# EAGLE board LED-Controller (EAGLE 5.11), part 1 of 2
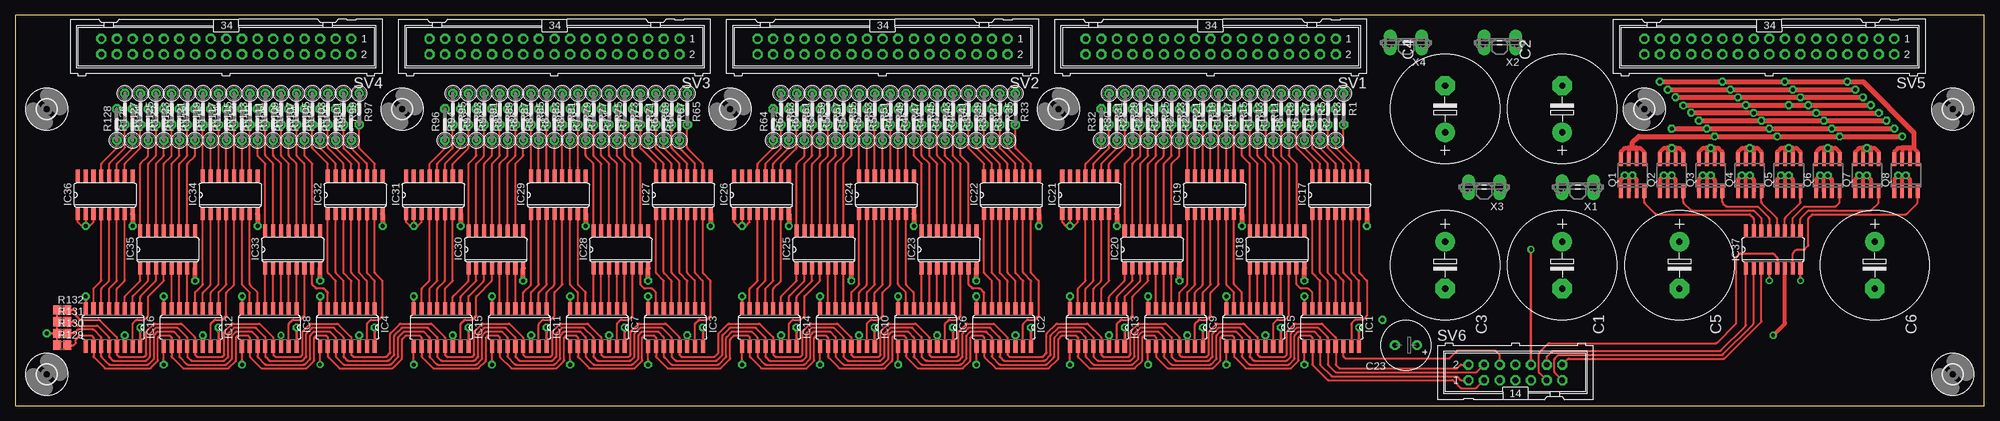
[diagram p3: board, top side]
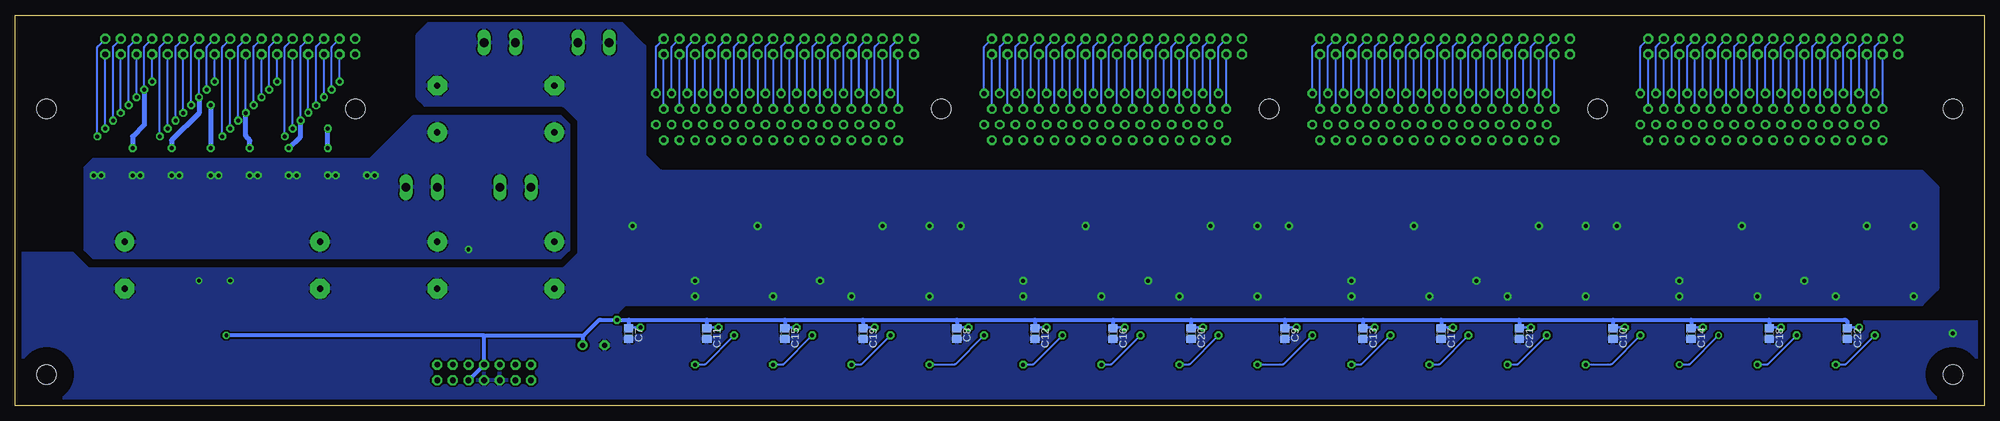
[diagram p4: board, bottom side, seen from below]

Size 320.04 x 63.5 mm. Coordinates in mm from the lower left corner, seen from the top.
Outline: 0,0 320.04,0 320.04,63.5 0,63.5 0,0
Copper layers (1*16): Top 0.035mm / dielectric 1.5mm / Bottom 0.035mm
Design rules "default *": minimum track width 10mil, minimum drill 24mil, track to track 8mil, track to pad 8mil, pad to pad 8mil, via to via 8mil, smd to smd 8mil, copper to edge 40mil, drill to drill 8mil, minimum pad ring 14mil, minimum via ring 10mil, stop-mask expansion 4mil, vias tented up to drill 0mil, thermal gap 10mil

## Footprints (pad centres in the part's own frame; a part is rotated, then mirrored left to right if it is on the bottom)
E7,5-18 = drill 1.016 pad 3.15 round: + -3.81,0 | drill 1.016 pad 3.15 octagon: - 3.81,0
C0805 = smd 1.3 x 1.5: 1 -0.85,0; 2 0.85,0
E3,5-8 = drill 0.813 pad 1.6 round: + -1.778,0 | drill 0.813 pad 1.6 octagon: - 1.778,0
SO16 = smd 0.66 x 2.032: 1 -4.445,-3.073; 2 -3.175,-3.073; 3 -1.905,-3.073; 4 -0.635,-3.073; 5 0.635,-3.073; 6 1.905,-3.073; 7 3.175,-3.073; 8 4.445,-3.073; 9 4.445,3.073; 10 3.175,3.073; 11 1.905,3.073; 12 0.635,3.073; 13 -0.635,3.073; 14 -1.905,3.073; 15 -3.175,3.073; 16 -4.445,3.073
SO-08 = smd 0.6 x 2.2: 1 -1.905,-2.6; 2 -0.635,-2.6; 3 0.635,-2.6; 4 1.905,-2.6; 5 1.905,2.6; 6 0.635,2.6; 7 -0.635,2.6; 8 -1.905,2.6
0207/5V = drill 0.813 octagon: 1 -2.54,0; 2 2.54,0
R0805 = smd 1.3 x 1.5: 1 -0.85,0; 2 0.85,0
ML34 = drill 0.914 octagon: 1 -20.32,-1.27; 2 -20.32,1.27; 3 -17.78,-1.27; 4 -17.78,1.27; 5 -15.24,-1.27; 6 -15.24,1.27; 7 -12.7,-1.27; 8 -12.7,1.27; 9 -10.16,-1.27; 10 -10.16,1.27; 11 -7.62,-1.27; 12 -7.62,1.27; 13 -5.08,-1.27; 14 -5.08,1.27; 15 -2.54,-1.27; 16 -2.54,1.27; 17 0,-1.27; 18 0,1.27; 19 2.54,-1.27; 20 2.54,1.27; 21 5.08,-1.27; 22 5.08,1.27; 23 7.62,-1.27; 24 7.62,1.27; 25 10.16,-1.27; 26 10.16,1.27; 27 12.7,-1.27; 28 12.7,1.27; 29 15.24,-1.27; 30 15.24,1.27; 31 17.78,-1.27; 32 17.78,1.27; 33 20.32,-1.27; 34 20.32,1.27
ML14 = drill 0.914 octagon: 1 -7.62,-1.27; 2 -7.62,1.27; 3 -5.08,-1.27; 4 -5.08,1.27; 5 -2.54,-1.27; 6 -2.54,1.27; 7 0,-1.27; 8 0,1.27; 9 2.54,-1.27; 10 2.54,1.27; 11 5.08,-1.27; 12 5.08,1.27; 13 7.62,-1.27; 14 7.62,1.27
3,2 = hole 3.2: 0,0
ST6,3 = drill 1.397 long: 1 -2.54,0; 2 2.54,0

## Placement (x,y rotation side)
C1  3300µ/10V  [E7,5-18]  251.46,22.86 270 top
C2  3300µ/10V  [E7,5-18]  251.46,48.26 90 top
C3  3300µ/10V  [E7,5-18]  232.41,22.86 270 top
C4  3300µ/10V  [E7,5-18]  232.41,48.26 90 top
C5  3300µ/10V  [E7,5-18]  270.51,22.86 270 top
C6  3300µ/10V  [E7,5-18]  302.26,22.86 270 top
C7  [C0805]  220.34,11.75 270 bottom
C8  [C0805]  167,11.75 270 bottom
C9  [C0805]  113.67,11.75 270 bottom
C10  [C0805]  60.33,11.75 270 bottom
C11  [C0805]  207.65,11.75 270 bottom
C12  [C0805]  154.31,11.75 270 bottom
C13  [C0805]  100.97,11.75 270 bottom
C14  [C0805]  47.62,11.75 270 bottom
C15  [C0805]  194.94,11.75 270 bottom
C16  [C0805]  141.6,11.75 270 bottom
C17  [C0805]  88.27,11.75 270 bottom
C18  [C0805]  34.92,11.75 270 bottom
C19  [C0805]  182.25,11.75 270 bottom
C20  [C0805]  128.91,11.75 270 bottom
C21  [C0805]  75.56,11.75 270 bottom
C22  [C0805]  22.23,11.75 270 bottom
C23  [E3,5-8]  226.06,9.84 180 top
IC1  74HCT595D  [SO16]  214,12.7 180 top
IC2  74HCT595D  [SO16]  160.66,12.7 180 top
IC3  74HCT595D  [SO16]  107.31,12.7 180 top
IC4  74HCT595D  [SO16]  53.98,12.7 180 top
IC5  74HCT595D  [SO16]  201.29,12.7 180 top
IC6  74HCT595D  [SO16]  147.96,12.7 180 top
IC7  74HCT595D  [SO16]  94.61,12.7 180 top
IC8  74HCT595D  [SO16]  41.27,12.7 180 top
IC9  74HCT595D  [SO16]  188.59,12.7 180 top
IC10  74HCT595D  [SO16]  135.25,12.7 180 top
IC11  74HCT595D  [SO16]  81.92,12.7 180 top
IC12  74HCT595D  [SO16]  28.57,12.7 180 top
IC13  74HCT595D  [SO16]  175.9,12.7 180 top
IC14  74HCT595D  [SO16]  122.56,12.7 180 top
IC15  74HCT595D  [SO16]  69.22,12.7 180 top
IC16  74HCT595D  [SO16]  15.88,12.7 180 top
IC17  ULN2003AD  [SO16]  215.26,34.29 0 top
IC18  ULN2003AD  [SO16]  205.1,25.4 0 top
IC19  ULN2003AD  [SO16]  194.94,34.29 0 top
IC20  ULN2003AD  [SO16]  184.78,25.4 0 top
IC21  ULN2003AD  [SO16]  174.62,34.29 0 top
IC22  ULN2003AD  [SO16]  161.93,34.29 0 top
IC23  ULN2003AD  [SO16]  151.76,25.4 0 top
IC24  ULN2003AD  [SO16]  141.6,34.29 0 top
IC25  ULN2003AD  [SO16]  131.44,25.4 0 top
IC26  ULN2003AD  [SO16]  121.28,34.29 0 top
IC27  ULN2003AD  [SO16]  108.58,34.29 0 top
IC28  ULN2003AD  [SO16]  98.42,25.4 0 top
IC29  ULN2003AD  [SO16]  88.27,34.29 0 top
IC30  ULN2003AD  [SO16]  78.11,25.4 0 top
IC31  ULN2003AD  [SO16]  67.94,34.29 0 top
IC32  ULN2003AD  [SO16]  55.24,34.29 0 top
IC33  ULN2003AD  [SO16]  45.09,25.4 0 top
IC34  ULN2003AD  [SO16]  34.92,34.29 0 top
IC35  ULN2003AD  [SO16]  24.77,25.4 0 top
IC36  ULN2003AD  [SO16]  14.61,34.29 0 top
IC37  74HCT138D  [SO16]  285.75,25.4 0 top
Q1  irf7416p  [SO-08]  262.89,37.46 0 top
Q2  irf7416p  [SO-08]  269.24,37.46 0 top
Q3  irf7416p  [SO-08]  275.59,37.46 0 top
Q4  irf7416p  [SO-08]  281.94,37.46 0 top
Q5  irf7416p  [SO-08]  288.29,37.46 0 top
Q6  irf7416p  [SO-08]  294.64,37.46 0 top
Q7  irf7416p  [SO-08]  300.99,37.46 0 top
Q8  irf7416p  [SO-08]  307.34,37.46 0 top
R1  [0207/5V]  215.9,48.26 270 top
R2  [0207/5V]  214.63,45.72 90 top
R3  [0207/5V]  213.36,48.26 270 top
R4  [0207/5V]  212.09,45.72 90 top
R5  [0207/5V]  210.82,48.26 270 top
R6  [0207/5V]  209.55,45.72 90 top
R7  [0207/5V]  208.28,48.26 270 top
R8  [0207/5V]  207.01,45.72 90 top
R9  [0207/5V]  205.74,48.26 270 top
R10  [0207/5V]  204.47,45.72 90 top
R11  [0207/5V]  203.2,48.26 270 top
R12  [0207/5V]  201.93,45.72 90 top
R13  [0207/5V]  200.66,48.26 270 top
R14  [0207/5V]  199.39,45.72 90 top
R15  [0207/5V]  198.12,48.26 270 top
R16  [0207/5V]  196.85,45.72 90 top
R17  [0207/5V]  195.58,48.26 270 top
R18  [0207/5V]  194.31,45.72 90 top
R19  [0207/5V]  193.04,48.26 270 top
R20  [0207/5V]  191.77,45.72 90 top
R21  [0207/5V]  190.5,48.26 270 top
R22  [0207/5V]  189.23,45.72 90 top
R23  [0207/5V]  187.96,48.26 270 top
R24  [0207/5V]  186.69,45.72 90 top
R25  [0207/5V]  185.42,48.26 270 top
R26  [0207/5V]  184.15,45.72 90 top
R27  [0207/5V]  182.88,48.26 270 top
R28  [0207/5V]  181.61,45.72 90 top
R29  [0207/5V]  180.34,48.26 270 top
R30  [0207/5V]  179.07,45.72 90 top
R31  [0207/5V]  177.8,48.26 270 top
R32  [0207/5V]  176.53,45.72 90 top
R33  [0207/5V]  162.56,48.26 270 top
R34  [0207/5V]  161.29,45.72 90 top
R35  [0207/5V]  160.02,48.26 270 top
R36  [0207/5V]  158.75,45.72 90 top
R37  [0207/5V]  157.48,48.26 270 top
R38  [0207/5V]  156.21,45.72 90 top
R39  [0207/5V]  154.94,48.26 270 top
R40  [0207/5V]  153.67,45.72 90 top
R41  [0207/5V]  152.4,48.26 270 top
R42  [0207/5V]  151.13,45.72 90 top
R43  [0207/5V]  149.86,48.26 270 top
R44  [0207/5V]  148.59,45.72 90 top
R45  [0207/5V]  147.32,48.26 270 top
R46  [0207/5V]  146.05,45.72 90 top
R47  [0207/5V]  144.78,48.26 270 top
R48  [0207/5V]  143.51,45.72 90 top
R49  [0207/5V]  142.24,48.26 270 top
R50  [0207/5V]  140.97,45.72 90 top
R51  [0207/5V]  139.7,48.26 270 top
R52  [0207/5V]  138.43,45.72 90 top
R53  [0207/5V]  137.16,48.26 270 top
R54  [0207/5V]  135.89,45.72 90 top
R55  [0207/5V]  134.62,48.26 270 top
R56  [0207/5V]  133.35,45.72 90 top
R57  [0207/5V]  132.08,48.26 270 top
R58  [0207/5V]  130.81,45.72 90 top
R59  [0207/5V]  129.54,48.26 270 top
R60  [0207/5V]  128.27,45.72 90 top
R61  [0207/5V]  127,48.26 270 top
R62  [0207/5V]  125.73,45.72 90 top
R63  [0207/5V]  124.46,48.26 270 top
R64  [0207/5V]  123.19,45.72 90 top
R65  [0207/5V]  109.22,48.26 270 top
R66  [0207/5V]  107.95,45.72 90 top
R67  [0207/5V]  106.68,48.26 270 top
R68  [0207/5V]  105.41,45.72 90 top
R69  [0207/5V]  104.14,48.26 270 top
R70  [0207/5V]  102.87,45.72 90 top
R71  [0207/5V]  101.6,48.26 270 top
R72  [0207/5V]  100.33,45.72 90 top
R73  [0207/5V]  99.06,48.26 270 top
R74  [0207/5V]  97.79,45.72 90 top
R75  [0207/5V]  96.52,48.26 270 top
R76  [0207/5V]  95.25,45.72 90 top
R77  [0207/5V]  93.98,48.26 270 top
R78  [0207/5V]  92.71,45.72 90 top
R79  [0207/5V]  91.44,48.26 270 top
R80  [0207/5V]  90.17,45.72 90 top
R81  [0207/5V]  88.9,48.26 270 top
R82  [0207/5V]  87.63,45.72 90 top
R83  [0207/5V]  86.36,48.26 270 top
R84  [0207/5V]  85.09,45.72 90 top
R85  [0207/5V]  83.82,48.26 270 top
R86  [0207/5V]  82.55,45.72 90 top
R87  [0207/5V]  81.28,48.26 270 top
R88  [0207/5V]  80.01,45.72 90 top
R89  [0207/5V]  78.74,48.26 270 top
R90  [0207/5V]  77.47,45.72 90 top
R91  [0207/5V]  76.2,48.26 270 top
R92  [0207/5V]  74.93,45.72 90 top
R93  [0207/5V]  73.66,48.26 270 top
R94  [0207/5V]  72.39,45.72 90 top
R95  [0207/5V]  71.12,48.26 270 top
R96  [0207/5V]  69.85,45.72 90 top
R97  [0207/5V]  55.88,48.26 270 top
R98  [0207/5V]  54.61,45.72 90 top
R99  [0207/5V]  53.34,48.26 270 top
R100  [0207/5V]  52.07,45.72 90 top
R101  [0207/5V]  50.8,48.26 270 top
R102  [0207/5V]  49.53,45.72 90 top
R103  [0207/5V]  48.26,48.26 270 top
R104  [0207/5V]  46.99,45.72 90 top
R105  [0207/5V]  45.72,48.26 270 top
R106  [0207/5V]  44.45,45.72 90 top
R107  [0207/5V]  43.18,48.26 270 top
R108  [0207/5V]  41.91,45.72 90 top
R109  [0207/5V]  40.64,48.26 270 top
R110  [0207/5V]  39.37,45.72 90 top
R111  [0207/5V]  38.1,48.26 270 top
R112  [0207/5V]  36.83,45.72 90 top
R113  [0207/5V]  35.56,48.26 270 top
R114  [0207/5V]  34.29,45.72 90 top
R115  [0207/5V]  33.02,48.26 270 top
R116  [0207/5V]  31.75,45.72 90 top
R117  [0207/5V]  30.48,48.26 270 top
R118  [0207/5V]  29.21,45.72 90 top
R119  [0207/5V]  27.94,48.26 270 top
R120  [0207/5V]  26.67,45.72 90 top
R121  [0207/5V]  25.4,48.26 270 top
R122  [0207/5V]  24.13,45.72 90 top
R123  [0207/5V]  22.86,48.26 270 top
R124  [0207/5V]  21.59,45.72 90 top
R125  [0207/5V]  20.32,48.26 270 top
R126  [0207/5V]  19.05,45.72 90 top
R127  [0207/5V]  17.78,48.26 270 top
R128  [0207/5V]  16.51,45.72 90 top
R129  390  [R0805]  7.62,9.84 0 top
R130  390  [R0805]  7.62,11.75 0 top
R131  390  [R0805]  7.62,13.65 0 top
R132  390  [R0805]  7.62,15.56 0 top
SV1  [ML34]  194.31,58.42 180 top
SV2  [ML34]  140.97,58.42 180 top
SV3  [ML34]  87.63,58.42 180 top
SV4  [ML34]  34.29,58.42 180 top
SV5  [ML34]  285.12,58.42 180 top
SV6  [ML14]  243.84,5.4 0 top
U$1  [3,2]  62.87,48.26 0 top
U$2  [3,2]  5.08,48.26 0 top
U$3  [3,2]  5.08,5.08 0 top
U$4  [3,2]  116.2,48.26 0 top
U$5  [3,2]  169.54,48.26 0 top
U$6  [3,2]  264.8,48.26 0 top
U$7  [3,2]  314.96,48.26 0 top
U$8  [3,2]  314.96,5.08 0 top
X1  [ST6,3]  254,35.56 180 top
X2  [ST6,3]  241.3,59.05 180 top
X3  [ST6,3]  238.76,35.56 180 top
X4  [ST6,3]  226.06,59.05 180 top

## Tracks (layer width: path | path; a pad name or v marks a point on that pad's centre or on a via)
!ACT
  Top 0.305: SV6.11 247.74,5.3 arc-45 247.65,5.53 247.65,8.44 arc-45 247.74,8.67 249.14,10.07 arc-45 249.37,10.16 276.41,10.16 arc45 276.63,10.25 279.62,13.24 arc45 279.72,13.47 279.72,24 arc-45 279.81,24.22 280.26,24.67 arc-45 280.48,24.77 285.62,24.77 arc-45 285.84,24.67 286.29,24.22 arc-45 286.38,24 IC37.5
!CLR_SHIFT
  Top 0.305: R129.2 9.39,9.84 arc45 9.62,9.94 9.75,10.07 arc45 9.84,10.29 9.84,10.66 arc-45 9.94,10.89 10.38,11.34 arc-45 10.61,11.43 12.25,11.43 arc-45 12.48,11.34 12.61,11.21 arc-45 12.7,10.98 IC16.10 12.7,8.07 arc45 12.79,7.84 14.51,6.13 arc45 14.74,6.03 21.78,6.03 arc45 22,6.13 23.08,7.21 arc45 23.18,7.43 23.18,10.98 arc-45 23.27,11.21 23.4,11.34 arc-45 23.63,11.43 24.95,11.43 arc-45 25.18,11.34 25.31,11.21 arc-45 25.4,10.98 IC12.10 25.4,8.07 arc45 25.49,7.84 27.21,6.13 arc45 27.44,6.03 34.48,6.03 arc45 34.7,6.13 35.78,7.21 arc45 35.88,7.43 35.88,10.98 arc-45 35.97,11.21 36.1,11.34 arc-45 36.33,11.43 37.65,11.43 arc-45 37.88,11.34 38.01,11.21 arc-45 38.1,10.98 IC8.10 38.1,8.07 arc45 38.19,7.84 39.91,6.13 arc45 40.14,6.03 47.18,6.03 arc45 47.4,6.13 48.48,7.21 arc45 48.58,7.43 48.58,10.98 arc-45 48.67,11.21 48.8,11.34 arc-45 49.03,11.43 50.35,11.43 arc-45 50.58,11.34 50.71,11.21 arc-45 50.8,10.98 IC4.10 50.8,8.07 arc45 50.89,7.84 52.61,6.13 arc45 52.84,6.03 61.15,6.03 arc45 61.37,6.13 62.77,7.53 arc45 62.87,7.75 62.87,10.66 arc-45 62.96,10.89 63.41,11.34 arc-45 63.63,11.43 65.59,11.43 arc-45 65.82,11.34 65.95,11.21 arc-45 66.04,10.98 IC15.10 66.04,8.07 arc45 66.13,7.84 67.85,6.13 arc45 68.08,6.03 75.12,6.03 arc45 75.34,6.13 76.42,7.21 arc45 76.52,7.43 76.52,10.98 arc-45 76.61,11.21 76.74,11.34 arc-45 76.97,11.43 78.29,11.43 arc-45 78.52,11.34 78.65,11.21 arc-45 78.74,10.98 IC11.10 78.74,8.07 arc45 78.83,7.84 80.55,6.13 arc45 80.78,6.03 87.82,6.03 arc45 88.04,6.13 89.12,7.21 arc45 89.22,7.43 89.22,10.98 arc-45 89.31,11.21 89.44,11.34 arc-45 89.67,11.43 90.99,11.43 arc-45 91.22,11.34 91.35,11.21 arc-45 91.44,10.98 IC7.10 91.44,8.07 arc45 91.53,7.84 93.25,6.13 arc45 93.48,6.03 100.52,6.03 arc45 100.74,6.13 101.83,7.21 arc45 101.92,7.43 101.92,10.98 arc-45 102.01,11.21 102.14,11.34 arc-45 102.37,11.43 103.69,11.43 arc-45 103.92,11.34 104.05,11.21 arc-45 104.14,10.98 IC3.10 104.14,8.07 arc45 104.23,7.84 105.95,6.13 arc45 106.18,6.03 114.49,6.03 arc45 114.71,6.13 116.11,7.53 arc45 116.2,7.75 116.2,10.66 arc-45 116.3,10.89 116.75,11.34 arc-45 116.97,11.43 118.93,11.43 arc-45 119.16,11.34 119.29,11.21 arc-45 119.38,10.98 IC14.10 119.38,8.07 arc45 119.47,7.84 121.19,6.13 arc45 121.42,6.03 128.46,6.03 arc45 128.68,6.13 129.76,7.21 arc45 129.86,7.43 129.86,10.98 arc-45 129.95,11.21 130.18,11.43 131.63,11.43 arc-45 131.86,11.34 131.99,11.21 arc-45 132.08,10.98 IC10.10 132.08,8.07 arc45 132.17,7.84 133.89,6.13 arc45 134.12,6.03 141.16,6.03 arc45 141.38,6.13 142.46,7.21 arc45 142.56,7.43 142.56,10.98 arc-45 142.65,11.21 142.78,11.34 arc-45 143.01,11.43 144.33,11.43 arc-45 144.56,11.34 144.69,11.21 arc-45 144.78,10.98 IC6.10 144.78,8.07 arc45 144.87,7.84 146.59,6.13 arc45 146.82,6.03 153.86,6.03 arc45 154.08,6.13 155.16,7.21 arc45 155.26,7.43 155.26,10.98 arc-45 155.35,11.21 155.48,11.34 arc-45 155.71,11.43 157.03,11.43 arc-45 157.26,11.34 157.39,11.21 arc-45 157.48,10.98 IC2.10 157.48,8.07 arc45 157.57,7.84 159.29,6.13 arc45 159.52,6.03 167.83,6.03 arc45 168.05,6.13 169.45,7.53 arc45 169.54,7.75 169.54,10.66 arc-45 169.64,10.89 170.09,11.34 arc-45 170.31,11.43 172.27,11.43 arc-45 172.5,11.34 172.63,11.21 arc-45 172.72,10.98 IC13.10 172.72,8.07 arc45 172.81,7.84 174.53,6.13 arc45 174.76,6.03 181.8,6.03 arc45 182.02,6.13 183.1,7.21 arc45 183.2,7.43 183.2,10.98 arc-45 183.29,11.21 183.42,11.34 arc-45 183.65,11.43 184.97,11.43 arc-45 185.2,11.34 185.33,11.21 arc-45 185.42,10.98 IC9.10 185.42,8.07 arc45 185.51,7.84 187.23,6.13 arc45 187.46,6.03 194.5,6.03 arc45 194.72,6.13 195.8,7.21 arc45 195.9,7.43 195.9,10.98 arc-45 195.99,11.21 196.12,11.34 arc-45 196.35,11.43 197.67,11.43 arc-45 197.9,11.34 198.03,11.21 arc-45 198.12,10.98 IC5.10 198.12,8.07 arc45 198.21,7.84 199.93,6.13 arc45 200.16,6.03 207.2,6.03 arc45 207.42,6.13 208.5,7.21 arc45 208.6,7.43 208.6,10.98 arc-45 208.69,11.21 208.82,11.34 arc-45 209.05,11.43 210.37,11.43 arc-45 210.59,11.34 210.73,11.21 arc-45 210.82,10.98 IC1.10 210.82,6.8 arc45 210.91,6.58 213.27,4.22 arc45 213.49,4.13 233.55,4.13 arc-45 233.77,4.03 234.86,2.95 arc45 235.08,2.86 237.36,2.86 arc45 237.58,2.95 SV6.3
!OE
  Top 0.305: R132.2 9.39,15.56 arc-45 9.62,15.46 9.75,15.33 arc-45 9.84,15.11 9.84,14.74 arc45 9.94,14.51 10.38,14.06 arc45 10.61,13.97 13.52,13.97 arc-45 13.74,13.88 16.42,11.21 arc-45 16.51,10.98 IC16.13 16.51,8.39 arc45 16.6,8.16 16.73,8.03 arc45 16.96,7.94 20.82,7.94 arc45 21.05,8.03 21.18,8.16 arc45 21.27,8.39 21.27,11.93 arc-45 21.37,12.16 22.45,13.24 arc-45 22.67,13.33 26.86,13.33 arc-45 27.08,13.24 29.12,11.21 arc-45 29.21,10.98 IC12.13 29.21,8.39 arc45 29.3,8.16 29.43,8.03 arc45 29.66,7.94 33.52,7.94 arc45 33.75,8.03 33.88,8.16 arc45 33.97,8.39 33.97,11.93 arc-45 34.07,12.16 35.15,13.24 arc-45 35.37,13.33 39.56,13.33 arc-45 39.78,13.24 41.82,11.21 arc-45 41.91,10.98 IC8.13 41.91,8.39 arc45 42,8.16 42.13,8.03 arc45 42.36,7.94 46.22,7.94 arc45 46.45,8.03 46.58,8.16 arc45 46.67,8.39 46.67,11.93 arc-45 46.77,12.16 47.85,13.24 arc-45 48.07,13.33 52.26,13.33 arc-45 52.48,13.24 54.52,11.21 arc-45 54.61,10.98 IC4.13 54.61,8.39 arc45 54.7,8.16 54.83,8.03 arc45 55.06,7.94 60.19,7.94 arc45 60.42,8.03 60.87,8.48 arc45 60.96,8.7 60.96,11.62 arc-45 61.05,11.84 62.45,13.24 arc-45 62.68,13.33 67.5,13.33 arc-45 67.72,13.24 69.76,11.21 arc-45 69.85,10.98 IC15.13 69.85,8.39 arc45 69.94,8.16 70.08,8.03 arc45 70.3,7.94 74.16,7.94 arc45 74.39,8.03 74.52,8.16 arc45 74.61,8.39 74.61,11.93 arc-45 74.71,12.16 75.79,13.24 arc-45 76.01,13.33 80.2,13.33 arc-45 80.42,13.24 82.46,11.21 arc-45 82.55,10.98 IC11.13 82.55,8.39 arc45 82.64,8.16 82.78,8.03 arc45 83,7.94 86.86,7.94 arc45 87.09,8.03 87.22,8.16 arc45 87.31,8.39 87.31,11.93 arc-45 87.41,12.16 88.49,13.24 arc-45 88.71,13.33 92.9,13.33 arc-45 93.12,13.24 95.16,11.21 arc-45 95.25,10.98 IC7.13 95.25,8.39 arc45 95.34,8.16 95.47,8.03 arc45 95.7,7.94 99.56,7.94 arc45 99.79,8.03 99.92,8.16 arc45 100.01,8.39 100.01,11.93 arc-45 100.11,12.16 101.19,13.24 arc-45 101.41,13.33 105.6,13.33 arc-45 105.82,13.24 107.86,11.21 arc-45 107.95,10.98 IC3.13 107.95,8.39 arc45 108.04,8.16 108.17,8.03 arc45 108.4,7.94 113.53,7.94 arc45 113.76,8.03 114.21,8.48 arc45 114.3,8.7 114.3,11.62 arc-45 114.39,11.84 115.79,13.24 arc-45 116.02,13.33 120.84,13.33 arc-45 121.06,13.24 123.1,11.21 arc-45 123.19,10.98 IC14.13 123.19,8.39 arc45 123.28,8.16 123.42,8.03 arc45 123.64,7.94 127.5,7.94 arc45 127.73,8.03 127.86,8.16 arc45 127.95,8.39 127.95,11.93 arc-45 128.05,12.16 129.13,13.24 arc-45 129.35,13.33 133.54,13.33 arc-45 133.76,13.24 135.8,11.21 arc-45 135.89,10.98 IC10.13 135.89,8.39 arc45 135.98,8.16 136.11,8.03 arc45 136.34,7.94 140.2,7.94 arc45 140.43,8.03 140.56,8.16 arc45 140.65,8.39 140.65,11.93 arc-45 140.75,12.16 141.83,13.24 arc-45 142.05,13.33 146.24,13.33 arc-45 146.46,13.24 148.5,11.21 arc-45 148.59,10.98 IC6.13 148.59,8.39 arc45 148.68,8.16 148.81,8.03 arc45 149.04,7.94 152.9,7.94 arc45 153.13,8.03 153.26,8.16 arc45 153.35,8.39 153.35,11.93 arc-45 153.45,12.16 154.53,13.24 arc-45 154.75,13.33 158.94,13.33 arc-45 159.16,13.24 161.2,11.21 arc-45 161.29,10.98 IC2.13 161.29,8.39 arc45 161.38,8.16 161.51,8.03 arc45 161.74,7.94 166.87,7.94 arc45 167.1,8.03 167.55,8.48 arc45 167.64,8.7 167.64,11.62 arc-45 167.73,11.84 169.13,13.24 arc-45 169.36,13.33 174.18,13.33 arc-45 174.4,13.24 176.44,11.21 arc-45 176.53,10.98 IC13.13 176.53,8.39 arc45 176.62,8.16 176.75,8.03 arc45 176.98,7.94 180.84,7.94 arc45 181.07,8.03 181.09,8.05 arc45 181.29,8.55 181.29,11.93 arc-45 181.39,12.16 182.47,13.24 arc-45 182.69,13.33 186.88,13.33 arc-45 187.1,13.24 189.14,11.21 arc-45 189.23,10.98 IC9.13 189.23,8.39 arc45 189.32,8.16 189.42,8.07 arc45 189.73,7.94 193.54,7.94 arc45 193.77,8.03 193.9,8.16 arc45 193.99,8.39 193.99,11.93 arc-45 194.09,12.16 195.17,13.24 arc-45 195.39,13.33 199.58,13.33 arc-45 199.8,13.24 201.84,11.21 arc-45 201.93,10.98 IC5.13 201.93,8.39 arc45 202.02,8.16 202.16,8.03 arc45 202.38,7.94 206.24,7.94 arc45 206.47,8.03 206.6,8.16 arc45 206.69,8.39 206.69,11.93 arc-45 206.79,12.16 207.87,13.24 arc-45 208.09,13.33 212.28,13.33 arc-45 212.5,13.24 214.54,11.21 arc-45 214.63,10.98 IC1.13 214.63,6.8 arc45 214.72,6.58 215.17,6.13 arc45 215.4,6.03 234.18,6.03 arc45 234.41,6.13 234.86,6.58 arc-45 235.08,6.67 SV6.2
!STROBE
  Top 0.305: R131.2 9.39,13.65 arc-45 9.62,13.56 10.07,13.11 arc45 10.29,13.02 13.2,13.02 arc-45 13.43,12.92 15.15,11.21 arc-45 15.24,10.98 IC16.12 15.24,8.07 arc45 15.33,7.84 15.78,7.39 arc45 16.01,7.3 21.14,7.3 arc45 21.37,7.39 21.81,7.84 arc45 21.91,8.07 21.91,11.62 arc-45 22,11.84 22.77,12.61 arc-45 22.99,12.7 26.22,12.7 arc-45 26.45,12.61 27.85,11.21 arc-45 27.94,10.98 IC12.12 27.94,8.07 arc45 28.03,7.84 28.48,7.39 arc45 28.71,7.3 33.84,7.3 arc45 34.07,7.39 34.51,7.84 arc45 34.61,8.07 34.61,11.62 arc-45 34.7,11.84 35.47,12.61 arc-45 35.69,12.7 38.92,12.7 arc-45 39.15,12.61 40.55,11.21 arc-45 40.64,10.98 IC8.12 40.64,8.07 arc45 40.73,7.84 41.18,7.39 arc45 41.41,7.3 46.54,7.3 arc45 46.77,7.39 47.22,7.84 arc45 47.31,8.07 47.31,11.62 arc-45 47.4,11.84 48.17,12.61 arc-45 48.39,12.7 51.62,12.7 arc-45 51.85,12.61 53.25,11.21 arc-45 53.34,10.98 IC4.12 53.34,8.07 arc45 53.43,7.84 53.88,7.39 arc45 54.11,7.3 60.51,7.3 arc45 60.74,7.39 61.5,8.16 arc45 61.59,8.39 61.59,11.3 arc-45 61.69,11.52 62.77,12.61 arc-45 63,12.7 66.86,12.7 arc-45 67.08,12.61 68.49,11.21 arc-45 68.58,10.98 IC15.12 68.58,8.07 arc45 68.67,7.84 69.12,7.39 arc45 69.35,7.3 74.48,7.3 arc45 74.71,7.39 75.15,7.84 arc45 75.25,8.07 75.25,11.62 arc-45 75.34,11.84 76.11,12.61 arc-45 76.33,12.7 79.56,12.7 arc-45 79.78,12.61 81.19,11.21 arc-45 81.28,10.98 IC11.12 81.28,8.07 arc45 81.37,7.84 81.82,7.39 arc45 82.05,7.3 87.18,7.3 arc45 87.41,7.39 87.86,7.84 arc45 87.95,8.07 87.95,11.62 arc-45 88.04,11.84 88.81,12.61 arc-45 89.03,12.7 92.26,12.7 arc-45 92.49,12.61 93.89,11.21 arc-45 93.98,10.98 IC7.12 93.98,8.07 arc45 94.07,7.84 94.52,7.39 arc45 94.75,7.3 99.88,7.3 arc45 100.11,7.39 100.56,7.84 arc45 100.65,8.07 100.65,11.62 arc-45 100.74,11.84 101.51,12.61 arc-45 101.73,12.7 104.96,12.7 arc-45 105.19,12.61 106.59,11.21 arc-45 106.68,10.98 IC3.12 106.68,8.07 arc45 106.77,7.84 107.22,7.39 arc45 107.45,7.3 113.85,7.3 arc45 114.08,7.39 114.84,8.16 arc45 114.94,8.39 114.94,11.3 arc-45 115.03,11.52 116.11,12.61 arc-45 116.34,12.7 120.2,12.7 arc-45 120.42,12.61 121.83,11.21 arc-45 121.92,10.98 IC14.12 121.92,8.07 arc45 122.01,7.84 122.46,7.39 arc45 122.69,7.3 127.82,7.3 arc45 128.05,7.39 128.49,7.84 arc45 128.59,8.07 128.59,11.62 arc-45 128.68,11.84 129.54,12.7 132.9,12.7 arc-45 133.12,12.61 134.53,11.21 arc-45 134.62,10.98 IC10.12 134.62,8.07 arc45 134.71,7.84 135.16,7.39 arc45 135.39,7.3 140.52,7.3 arc45 140.75,7.39 141.19,7.84 arc45 141.29,8.07 141.29,11.62 arc-45 141.38,11.84 142.15,12.61 arc-45 142.37,12.7 145.6,12.7 arc-45 145.83,12.61 147.23,11.21 arc-45 147.32,10.98 IC6.12 147.32,8.07 arc45 147.41,7.84 147.77,7.49 arc45 148.22,7.3 153.22,7.3 arc45 153.45,7.39 153.89,7.84 arc45 153.99,8.07 153.99,11.62 arc-45 154.08,11.84 154.85,12.61 arc-45 155.07,12.7 158.3,12.7 arc-45 158.53,12.61 159.93,11.21 arc-45 160.02,10.98 IC2.12 160.02,8.07 arc45 160.11,7.84 160.56,7.39 arc45 160.79,7.3 167.19,7.3 arc45 167.42,7.39 168.18,8.16 arc45 168.28,8.39 168.28,11.3 arc-45 168.37,11.52 169.45,12.61 arc-45 169.68,12.7 173.54,12.7 arc-45 173.77,12.61 175.17,11.21 arc-45 175.26,10.98 IC13.12 175.26,8.07 arc45 175.35,7.84 175.8,7.39 arc45 176.03,7.3 181.16,7.3 arc45 181.39,7.39 181.83,7.84 arc45 181.93,8.07 181.93,11.62 arc-45 182.02,11.84 182.79,12.61 arc-45 183.01,12.7 186.24,12.7 arc-45 186.47,12.61 187.87,11.21 arc-45 187.96,10.98 IC9.12 187.96,8.07 arc45 188.05,7.84 188.5,7.39 arc45 188.73,7.3 193.86,7.3 arc45 194.09,7.39 194.53,7.84 arc45 194.63,8.07 194.63,11.62 arc-45 194.72,11.84 195.49,12.61 arc-45 195.71,12.7 198.94,12.7 arc-45 199.17,12.61 200.57,11.21 arc-45 200.66,10.98 IC5.12 200.66,8.07 arc45 200.75,7.84 201.2,7.39 arc45 201.43,7.3 206.56,7.3 arc45 206.79,7.39 207.23,7.84 arc45 207.33,8.07 207.33,11.62 arc-45 207.42,11.84 208.19,12.61 arc-45 208.41,12.7 211.64,12.7 arc-45 211.87,12.61 213.27,11.21 arc-45 213.36,10.98 IC1.12 213.36,6.8 arc45 213.45,6.58 214.54,5.49 arc45 214.76,5.4 237.36,5.4 arc45 237.58,5.49 SV6.4
+5V  (via drill 0.6, 0.65 pad 1.27)
  Top 0.406: v20.32,12.7 IC16.16 | v193.04,12.7 IC9.16 | v205.74,12.7 IC5.16 | v218.44,12.7 IC1.16 | v180.34,12.7 IC13.16 | v165.1,12.7 IC2.16 | v152.4,12.7 IC6.16 | v139.7,12.7 IC10.16 | v127,12.7 IC14.16 | v111.76,12.7 IC3.16 | v99.06,12.7 IC7.16 | v86.36,12.7 IC11.16 | v73.66,12.7 IC15.16 | v58.42,12.7 IC4.16 | v45.72,12.7 IC8.16 | v33.02,12.7 IC12.16
  Top 0.61: v285.75,11.43 287.56,13.24 arc45 287.65,13.47 IC37.6
  Bottom 0.406: v20.32,12.7 22.23,12.7 C22.1 | v218.44,12.7 220.24,12.7 arc-90 C7.1 | v205.74,12.7 207.54,12.7 arc-90 C11.1 | v193.04,12.7 194.84,12.7 arc-90 C15.1 | v180.34,12.7 182.14,12.7 arc-90 C19.1 | v165.1,12.7 166.9,12.7 arc-90 C8.1 | v152.4,12.7 154.2,12.7 arc-90 C12.1 | v139.7,12.7 141.5,12.7 arc-90 C16.1 | v127,12.7 128.8,12.7 arc-90 C20.1 | v111.76,12.7 113.56,12.7 arc-90 C9.1 | v99.06,12.7 100.86,12.7 arc-90 C13.1 | v86.36,12.7 88.16,12.7 arc-90 C17.1 | v73.66,12.7 75.46,12.7 arc-90 C21.1 | v58.42,12.7 60.22,12.7 arc-90 C10.1 | v33.02,12.7 34.82,12.7 arc-90 C18.1 | v45.72,12.7 47.52,12.7 arc-90 C14.1
  Bottom 0.61: 22.23,12.7 22.23,13.65 22.45,13.88 arc-45 22.67,13.97 34.92,13.97 | 34.92,13.97 C18.1 | 47.62,13.97 34.92,13.97 | 47.62,13.97 C14.1 | 60.33,13.97 47.62,13.97 | 60.33,13.97 C10.1 | 75.56,13.97 60.33,13.97 | 75.56,13.97 C21.1 | 88.27,13.97 75.56,13.97 | 88.27,13.97 C17.1 | 100.97,13.97 88.27,13.97 | 100.97,13.97 C13.1 | 113.67,13.97 100.97,13.97 | 113.67,13.97 C9.1 | 128.91,13.97 113.67,13.97 | 128.91,13.97 C20.1 | 141.6,13.97 128.91,13.97 | 141.6,13.97 C16.1 | 154.31,13.97 141.6,13.97 | 154.31,13.97 C12.1 | 167,13.97 154.31,13.97 | 167,13.97 C8.1 | 182.25,13.97 167,13.97 | 182.25,13.97 C19.1 | 194.94,13.97 182.25,13.97 | 194.94,13.97 C15.1 | 207.65,13.97 194.94,13.97 | 207.65,13.97 C11.1 | 220.34,13.97 207.65,13.97 | 220.34,13.97 C7.1 | 220.34,13.97 v222.25,13.97 224.98,13.97 arc-45 225.2,13.88 227.65,11.43 227.84,11.43 | 243.84,11.43 SV6.8 SV6.9 | 243.84,11.43 v285.75,11.43 | 227.84,11.43 C23.+ | 243.84,11.43 227.84,11.43
BL0_0
  Top 0.305: IC1.15 217.17,13.2 arc-45 217.26,13.43 217.71,13.88 arc-45 217.94,13.97 218.94,13.97 arc45 219.17,14.06 219.62,14.51 arc45 219.71,14.74 219.71,20.19 arc45 219.62,20.41 218.53,21.5 arc-45 218.44,21.72 IC17.7
BL0_1
  Top 0.305: IC1.1 218.44,20.19 arc45 218.35,20.41 217.26,21.5 arc-45 217.17,21.72 IC17.6
BL0_2
  Top 0.305: IC1.2 217.17,20.32 215.99,21.5 arc-45 215.9,21.72 IC17.5
BL0_3
  Top 0.305: IC1.3 215.9,20.19 arc45 215.81,20.41 214.72,21.5 arc-45 214.63,21.72 IC17.4
BL0_4
  Top 0.305: IC1.4 214.63,20.19 arc45 214.54,20.41 213.45,21.5 arc-45 213.36,21.72 IC17.3
BL0_5
  Top 0.305: IC1.5 213.36,20.19 arc45 213.27,20.41 212.18,21.5 arc-45 212.09,21.72 IC17.2
BL0_6
  Top 0.305: IC1.6 212.09,20.19 arc45 212,20.41 210.91,21.5 arc-45 210.82,21.72 IC17.1
BL0_7
  Top 0.305: IC1.7 210.82,18.28 arc45 210.73,18.51 210.28,18.96 arc45 210.05,19.05 209.05,19.05 arc-45 208.82,19.14 208.37,19.59 arc-45 208.28,19.82 IC18.7
BL0_8
  Top 0.305: IC5.15 204.47,13.2 arc-45 204.56,13.43 205.01,13.88 arc-45 205.24,13.97 206.24,13.97 arc45 206.47,14.06 206.92,14.51 arc45 207.01,14.74 IC18.6
BL0_9
  Top 0.305: IC5.1 IC18.5
BL0_10
  Top 0.305: IC5.2 IC18.4
BL0_11
  Top 0.305: IC5.3 IC18.3
BL0_12
  Top 0.305: IC5.4 IC18.2
BL0_13
  Top 0.305: IC5.5 IC18.1
BL0_14
  Top 0.305: IC5.6 199.39,18.28 arc45 199.3,18.51 198.21,19.59 arc-45 198.12,19.82 IC19.7
BL0_15
  Top 0.305: IC5.7 198.12,18.28 arc45 198.03,18.51 196.94,19.59 arc-45 196.85,19.82 IC19.6
BL0_16
  Top 0.305: IC9.15 191.77,13.2 arc-45 191.86,13.43 192.31,13.88 arc-45 192.54,13.97 193.54,13.97 arc45 193.77,14.06 194.22,14.51 arc45 194.31,14.74 194.31,18.28 arc-45 194.4,18.51 195.49,19.59 arc45 195.58,19.82 IC19.5
BL0_17
  Top 0.305: IC9.1 193.04,18.28 arc-45 193.13,18.51 194.22,19.59 arc45 194.31,19.82 IC19.4
BL0_18
  Top 0.305: IC9.2 191.77,18.28 arc-45 191.86,18.51 192.95,19.59 arc45 193.04,19.82 IC19.3
BL0_19
  Top 0.305: IC9.3 190.5,18.28 arc-45 190.59,18.51 191.68,19.59 arc45 191.77,19.82 IC19.2
BL0_20
  Top 0.305: IC9.4 189.23,18.28 arc-45 189.32,18.51 190.41,19.59 arc45 190.5,19.82 IC19.1
BL0_21
  Top 0.305: IC9.5 IC20.7
BL0_22
  Top 0.305: IC9.6 IC20.6
BL0_23
  Top 0.305: IC9.7 IC20.5
BL0_24
  Top 0.305: IC13.15 179.07,13.2 arc-45 179.16,13.43 179.61,13.88 arc-45 179.84,13.97 180.84,13.97 arc45 181.07,14.06 181.52,14.51 arc45 181.61,14.74 181.61,17.65 arc-45 181.7,17.87 184.06,20.23 arc45 184.15,20.45 IC20.4
BL0_25
  Top 0.305: IC13.1 180.34,17.65 arc-45 180.43,17.87 182.79,20.23 arc45 182.88,20.45 IC20.3
BL0_26
  Top 0.305: IC13.2 179.07,17.65 arc-45 179.16,17.87 181.52,20.23 arc45 181.61,20.45 IC20.2
BL0_27
  Top 0.305: IC13.3 177.8,17.65 arc-45 177.89,17.87 180.25,20.23 arc45 180.34,20.45 IC20.1
BL0_28
  Top 0.305: IC13.4 176.53,18.92 arc-45 176.62,19.14 177.71,20.23 arc45 177.8,20.45 IC21.7
BL0_29
  Top 0.305: IC13.5 175.26,18.92 arc-45 175.35,19.14 176.44,20.23 arc45 176.53,20.45 IC21.6
BL0_30
  Top 0.305: IC13.6 173.99,18.92 arc-45 174.08,19.14 175.17,20.23 arc45 175.26,20.45 IC21.5
BL0_31
  Top 0.305: IC13.7 172.72,18.92 arc-45 172.81,19.14 173.9,20.23 arc45 173.99,20.45 IC21.4
BL1_0
  Top 0.305: IC2.15 163.83,13.2 arc-45 163.92,13.43 164.37,13.88 arc-45 164.6,13.97 165.6,13.97 arc45 165.83,14.06 166.28,14.51 arc45 166.37,14.74 166.37,20.19 arc45 166.28,20.41 165.19,21.5 arc-45 165.1,21.72 IC22.7
BL1_1
  Top 0.305: IC2.1 165.1,20.19 arc45 165.01,20.41 163.92,21.5 arc-45 163.83,21.72 IC22.6
BL1_2
  Top 0.305: IC2.2 163.83,20.19 arc45 163.74,20.41 162.65,21.5 arc-45 162.56,21.72 IC22.5
BL1_3
  Top 0.305: IC22.4 161.29,21.72 arc45 161.38,21.5 162.47,20.41 arc-45 162.56,20.19 IC2.3
BL1_4
  Top 0.305: IC2.4 161.29,20.19 arc45 161.2,20.41 160.11,21.5 arc-45 160.02,21.72 IC22.3
BL1_5
  Top 0.305: IC22.2 158.75,21.72 arc45 158.84,21.5 159.93,20.41 arc-45 160.02,20.19 IC2.5
BL1_6
  Top 0.305: IC2.6 158.75,20.19 arc45 158.66,20.41 157.57,21.5 arc-45 157.48,21.72 IC22.1
BL1_7
  Top 0.305: IC2.7 157.48,18.28 arc45 157.39,18.51 156.94,18.96 arc45 156.71,19.05 155.71,19.05 arc-45 155.48,19.14 155.03,19.59 arc-45 154.94,19.82 IC23.7
BL1_8
  Top 0.305: IC6.15 151.13,13.2 arc-45 151.22,13.43 151.67,13.88 arc-45 151.9,13.97 152.9,13.97 arc45 153.13,14.06 153.58,14.51 arc45 153.67,14.74 IC23.6
BL1_9
  Top 0.305: IC6.1 IC23.5
BL1_10
  Top 0.305: IC6.2 IC23.4
BL1_11
  Top 0.305: IC6.3 IC23.3
BL1_12
  Top 0.305: IC6.4 IC23.2
BL1_13
  Top 0.305: IC6.5 IC23.1
BL1_14
  Top 0.305: IC6.6 146.05,18.28 arc45 145.96,18.51 144.87,19.59 arc-45 144.78,19.82 IC24.7
BL1_15
  Top 0.305: IC6.7 144.78,18.28 arc45 144.69,18.51 143.6,19.59 arc-45 143.51,19.82 IC24.6
BL1_16
  Top 0.305: IC10.15 138.43,13.2 arc-45 138.52,13.43 138.97,13.88 arc-45 139.2,13.97 140.2,13.97 arc45 140.43,14.06 140.88,14.51 arc45 140.97,14.74 140.97,18.28 arc-45 141.06,18.51 142.15,19.59 arc45 142.24,19.82 IC24.5
BL1_17
  Top 0.305: IC10.1 139.7,18.28 arc-45 139.79,18.51 140.88,19.59 arc45 140.97,19.82 IC24.4
BL1_18
  Top 0.305: IC10.2 138.43,18.28 arc-45 138.52,18.51 139.61,19.59 arc45 139.7,19.82 IC24.3
BL1_19
  Top 0.305: IC10.3 137.16,18.28 arc-45 137.25,18.51 138.34,19.59 arc45 138.43,19.82 IC24.2
BL1_20
  Top 0.305: IC10.4 135.89,18.28 arc-45 135.98,18.51 137.07,19.59 arc45 137.16,19.82 IC24.1
BL1_21
  Top 0.305: IC10.5 IC25.7
BL1_22
  Top 0.305: IC10.6 IC25.6
BL1_23
  Top 0.305: IC10.7 IC25.5
BL1_24
  Top 0.305: IC14.15 125.73,13.2 arc-45 125.82,13.43 126.27,13.88 arc-45 126.5,13.97 127.5,13.97 arc45 127.73,14.06 128.18,14.51 arc45 128.27,14.74 128.27,17.65 arc-45 128.36,17.87 130.72,20.23 arc45 130.81,20.45 IC25.4
BL1_25
  Top 0.305: IC14.1 127,17.52 arc-45 127.19,17.97 129.45,20.23 arc45 129.54,20.45 IC25.3
BL1_26
  Top 0.305: IC14.2 125.73,17.52 arc-45 125.92,17.97 128.18,20.23 arc45 128.27,20.45 IC25.2
BL1_27
  Top 0.305: IC14.3 124.46,17.65 arc-45 124.55,17.87 126.91,20.23 arc45 127,20.45 IC25.1
BL1_28
  Top 0.305: IC14.4 123.19,18.92 arc-45 123.28,19.14 124.37,20.23 arc45 124.46,20.45 IC26.7
BL1_29
  Top 0.305: IC14.5 121.92,18.92 arc-45 122.01,19.14 123.1,20.23 arc45 123.19,20.45 IC26.6
BL1_30
  Top 0.305: IC14.6 120.65,18.92 arc-45 120.74,19.14 121.83,20.23 arc45 121.92,20.45 IC26.5
BL1_31
  Top 0.305: IC14.7 119.38,18.92 arc-45 119.47,19.14 120.56,20.23 arc45 120.65,20.45 IC26.4
BL2_0
  Top 0.305: IC3.15 110.49,13.2 arc-45 110.58,13.43 111.03,13.88 arc-45 111.26,13.97 112.26,13.97 arc45 112.49,14.06 112.94,14.51 arc45 113.03,14.74 113.03,20.19 arc45 112.94,20.41 111.85,21.5 arc-45 111.76,21.72 IC27.7
BL2_1
  Top 0.305: IC27.6 110.49,21.72 arc45 110.58,21.5 111.67,20.41 arc-45 111.76,20.19 IC3.1
BL2_2
  Top 0.305: IC3.2 110.49,20.19 arc45 110.4,20.41 109.31,21.5 arc-45 109.22,21.72 IC27.5
BL2_3
  Top 0.305: IC27.4 107.95,21.72 arc45 108.04,21.5 109.13,20.41 arc-45 109.22,20.19 IC3.3
BL2_4
  Top 0.305: IC3.4 107.95,20.19 arc45 107.86,20.41 106.77,21.5 arc-45 106.68,21.72 IC27.3
BL2_5
  Top 0.305: IC27.2 105.41,21.72 arc45 105.5,21.5 106.59,20.41 arc-45 106.68,20.19 IC3.5
BL2_6
  Top 0.305: IC3.6 105.41,20.19 arc45 105.32,20.41 104.23,21.5 arc-45 104.14,21.72 IC27.1
BL2_7
  Top 0.305: IC3.7 104.14,18.28 arc45 104.05,18.51 103.6,18.96 arc45 103.37,19.05 102.37,19.05 arc-45 102.14,19.14 101.69,19.59 arc-45 101.6,19.82 IC28.7
BL2_8
  Top 0.305: IC7.15 97.79,13.2 arc-45 97.88,13.43 98.33,13.88 arc-45 98.56,13.97 99.56,13.97 arc45 99.79,14.06 100.24,14.51 arc45 100.33,14.74 IC28.6
BL2_9
  Top 0.305: IC7.1 IC28.5
BL2_10
  Top 0.305: IC7.2 IC28.4
BL2_11
  Top 0.305: IC7.3 IC28.3
BL2_12
  Top 0.305: IC7.4 IC28.2
BL2_13
  Top 0.305: IC7.5 IC28.1
BL2_14
  Top 0.305: IC7.6 92.71,18.28 arc45 92.62,18.51 91.53,19.59 arc-45 91.44,19.82 IC29.7
BL2_15
  Top 0.305: IC7.7 91.44,18.28 arc45 91.35,18.51 90.26,19.59 arc-45 90.17,19.82 IC29.6
BL2_16
  Top 0.305: IC11.15 85.09,13.2 arc-45 85.18,13.43 85.63,13.88 arc-45 85.86,13.97 86.86,13.97 arc45 87.09,14.06 87.54,14.51 arc45 87.63,14.74 87.63,18.28 arc-45 87.72,18.51 88.81,19.59 arc45 88.9,19.82 IC29.5
BL2_17
  Top 0.305: IC11.1 86.36,18.28 arc-45 86.45,18.51 87.54,19.59 arc45 87.63,19.82 IC29.4
BL2_18
  Top 0.305: IC11.2 85.09,18.28 arc-45 85.18,18.51 86.27,19.59 arc45 86.36,19.82 IC29.3
BL2_19
  Top 0.305: IC11.3 83.82,18.28 arc-45 83.91,18.51 85,19.59 arc45 85.09,19.82 IC29.2
BL2_20
  Top 0.305: IC11.4 82.55,18.28 arc-45 82.64,18.51 83.73,19.59 arc45 83.82,19.82 IC29.1
BL2_21
  Top 0.305: IC11.5 IC30.7
BL2_22
  Top 0.305: IC11.6 IC30.6
BL2_23
  Top 0.305: IC11.7 IC30.5
BL2_24
  Top 0.305: IC15.15 72.39,13.2 arc-45 72.48,13.43 72.93,13.88 arc-45 73.16,13.97 74.16,13.97 arc45 74.39,14.06 74.84,14.51 arc45 74.93,14.74 74.93,17.65 arc-45 75.02,17.87 77.38,20.23 arc45 77.47,20.45 IC30.4
BL2_25
  Top 0.305: IC15.1 73.66,17.65 arc-45 73.75,17.87 76.01,20.13 arc45 76.2,20.58 IC30.3
BL2_26
  Top 0.305: IC15.2 72.39,17.65 arc-45 72.48,17.87 74.84,20.23 arc45 74.93,20.45 IC30.2
BL2_27
  Top 0.305: IC30.1 73.66,20.45 arc-45 73.57,20.23 71.21,17.87 arc45 71.12,17.65 IC15.3
BL2_28
  Top 0.305: IC15.4 69.85,18.92 arc-45 69.94,19.14 71.03,20.23 arc45 71.12,20.45 IC31.7
BL2_29
  Top 0.305: IC15.5 68.58,18.92 arc-45 68.67,19.14 69.76,20.23 arc45 69.85,20.45 IC31.6
BL2_30
  Top 0.305: IC15.6 67.31,18.92 arc-45 67.4,19.14 68.49,20.23 arc45 68.58,20.45 IC31.5
BL2_31
  Top 0.305: IC31.4 67.31,20.45 arc-45 67.22,20.23 66.13,19.14 arc45 66.04,18.92 IC15.7
BL3_0
  Top 0.305: IC4.15 57.15,13.2 arc-45 57.24,13.43 57.69,13.88 arc-45 57.92,13.97 58.92,13.97 arc45 59.15,14.06 59.6,14.51 arc45 59.69,14.74 59.69,20.19 arc45 59.6,20.41 58.51,21.5 arc-45 58.42,21.72 IC32.7
BL3_1
  Top 0.305: IC4.1 58.42,20.19 arc45 58.33,20.41 57.24,21.5 arc-45 57.15,21.72 IC32.6
BL3_2
  Top 0.305: IC32.5 55.88,21.72 arc45 55.97,21.5 57.06,20.41 arc-45 57.15,20.19 IC4.2
BL3_3
  Top 0.305: IC4.3 55.88,20.19 arc45 55.79,20.41 54.7,21.5 arc-45 54.61,21.72 IC32.4
BL3_4
  Top 0.305: IC4.4 54.61,20.19 arc45 54.52,20.41 53.43,21.5 arc-45 53.34,21.72 IC32.3
BL3_5
  Top 0.305: IC32.2 52.07,21.72 arc45 52.16,21.5 53.25,20.41 arc-45 53.34,20.19 IC4.5
BL3_6
  Top 0.305: IC4.6 52.07,20.19 arc45 51.98,20.41 50.89,21.5 arc-45 50.8,21.72 IC32.1
BL3_7
  Top 0.305: IC33.7 48.26,19.82 arc45 48.35,19.59 48.8,19.14 arc45 49.03,19.05 50.03,19.05 arc-45 50.26,18.96 50.71,18.51 arc-45 50.8,18.28 IC4.7
BL3_8
  Top 0.305: IC8.15 44.45,13.2 arc-45 44.54,13.43 44.99,13.88 arc-45 45.22,13.97 46.22,13.97 arc45 46.45,14.06 46.9,14.51 arc45 46.99,14.74 IC33.6
BL3_9
  Top 0.305: IC8.1 IC33.5
BL3_10
  Top 0.305: IC8.2 IC33.4
BL3_11
  Top 0.305: IC8.3 IC33.3
BL3_12
  Top 0.305: IC8.4 IC33.2
BL3_13
  Top 0.305: IC8.5 IC33.1
BL3_14
  Top 0.305: IC34.7 38.1,19.82 arc45 38.19,19.59 39.28,18.51 arc-45 39.37,18.28 IC8.6
BL3_15
  Top 0.305: IC8.7 38.1,18.28 arc45 38.01,18.51 36.92,19.59 arc-45 36.83,19.82 IC34.6
BL3_16
  Top 0.305: IC34.5 35.56,19.82 arc-45 35.47,19.59 34.38,18.51 arc45 34.29,18.28 34.29,14.74 arc-45 34.2,14.51 33.75,14.06 arc-45 33.52,13.97 32.52,13.97 arc45 32.29,13.88 31.84,13.43 arc45 31.75,13.2 IC12.15
BL3_17
  Top 0.305: IC12.1 33.02,18.28 arc-45 33.11,18.51 34.2,19.59 arc45 34.29,19.82 IC34.4
BL3_18
  Top 0.305: IC12.2 31.75,18.28 arc-45 31.84,18.51 32.93,19.59 arc45 33.02,19.82 IC34.3
BL3_19
  Top 0.305: IC34.2 31.75,19.82 arc-45 31.66,19.59 30.57,18.51 arc45 30.48,18.28 IC12.3
BL3_20
  Top 0.305: IC12.4 29.21,18.28 arc-45 29.3,18.51 30.39,19.59 arc45 30.48,19.82 IC34.1
BL3_21
  Top 0.305: IC12.5 IC35.7
BL3_22
  Top 0.305: IC12.6 IC35.6
BL3_23
  Top 0.305: IC12.7 IC35.5
BL3_24
  Top 0.305: IC16.15 19.05,13.2 arc-45 19.14,13.43 19.59,13.88 arc-45 19.82,13.97 20.82,13.97 arc45 21.05,14.06 21.5,14.51 arc45 21.59,14.74 21.59,17.65 arc-45 21.68,17.87 24.04,20.23 arc45 24.13,20.45 IC35.4
BL3_25
  Top 0.305: IC35.3 22.86,20.45 arc-45 22.77,20.23 20.41,17.87 arc45 20.32,17.65 IC16.1
BL3_26
  Top 0.305: IC16.2 19.05,17.65 arc-45 19.14,17.87 21.5,20.23 arc45 21.59,20.45 IC35.2
BL3_27
  Top 0.305: IC35.1 20.32,20.45 arc-45 20.23,20.23 17.87,17.87 arc45 17.78,17.65 IC16.3
BL3_28
  Top 0.305: IC16.4 16.51,18.92 arc-45 16.6,19.14 17.69,20.23 arc45 17.78,20.45 IC36.7
BL3_29
  Top 0.305: IC36.6 16.51,20.45 arc-45 16.42,20.23 15.33,19.14 arc45 15.24,18.92 IC16.5
BL3_30
  Top 0.305: IC16.6 13.97,18.92 arc-45 14.06,19.14 15.15,20.23 arc45 15.24,20.45 IC36.5
BL3_31
  Top 0.305: IC36.4 13.97,20.45 arc-45 13.88,20.23 12.79,19.14 arc45 12.7,18.92 IC16.7
GND  (via drill 0.6, 0.65 pad 1.27)
  Top 0.305: IC21.2 v171.45,29.21 | v171.45,29.21 170.81,29.21 170.18,29.84 IC21.1 | v171.45,29.21 172.09,29.21 172.72,29.84 IC21.3 | IC26.1 116.84,29.84 117.47,29.21 v118.11,29.21 | IC26.2 v118.11,29.21 | v118.11,29.21 118.75,29.21 119.38,29.84 IC26.3 | IC31.1 63.5,29.84 64.14,29.21 v64.77,29.21 | IC31.2 v64.77,29.21 | v64.77,29.21 65.41,29.21 66.04,29.84 IC31.3 | IC36.1 10.16,29.84 10.79,29.21 v11.43,29.21 | IC36.2 v11.43,29.21 | v11.43,29.21 12.06,29.21 12.7,29.84 IC36.3 | R129.1 R130.1 R131.1 R132.1
  Top 0.406: IC16.8 v11.43,17.78 | IC12.8 v24.13,17.78 | IC8.8 v36.83,17.78 | IC4.8 v49.53,17.78 | IC15.8 v64.77,17.78 | IC11.8 v77.47,17.78 | IC7.8 v90.17,17.78 | IC3.8 v102.87,17.78 | IC14.8 v118.11,17.78 | IC10.8 v130.81,17.78 | IC6.8 v143.51,17.78 | IC2.8 v156.21,17.78 | IC13.8 v171.45,17.78 | IC9.8 v184.15,17.78 | IC5.8 v196.85,17.78 | IC1.8 v209.55,17.78 | v285.12,20.32 IC37.4 | v290.19,20.32 IC37.8 | R130.1 v5.08,11.75
  Top 0.813: IC17.8 v219.71,29.21 | v209.55,20.32 IC18.8 | v189.23,20.32 IC20.8 | IC21.8 v179.07,29.21 | IC19.8 v199.39,29.21 | IC22.8 v166.37,29.21 | v156.21,20.32 IC23.8 | IC24.8 v146.05,29.21 | v135.89,20.32 IC25.8 | IC27.8 v113.03,29.21 | v102.87,20.32 IC28.8 | IC29.8 v92.71,29.21 | v82.55,20.32 IC30.8 | IC31.8 v72.39,29.21 | IC32.8 v59.69,29.21 | v49.53,20.32 IC33.8 | IC34.8 v39.37,29.21 | v29.21,20.32 IC35.8 | IC36.8 v19.05,29.21 | IC26.8 v125.73,29.21
  pour Bottom (isolate 0.305): 230.95,22.23 arc-45 230.73,22.32 228.38,24.67 arc-45 228.28,24.9 228.28,46.22 arc-45 228.38,46.45 230.73,48.8 arc-45 230.95,48.89 253.23,48.89 arc45 253.46,48.99 254.54,50.07 arc45 254.63,50.3 254.63,60.19 arc45 254.54,60.42 252.82,62.14 arc45 252.6,62.23 221.75,62.23 arc45 221.52,62.14 217.9,58.51 arc45 217.81,58.29 217.81,40.77 arc-45 217.71,40.55 215.36,38.19 arc-45 215.13,38.1 10.29,38.1 arc45 10.07,38.01 7.71,35.65 arc45 7.62,35.43 7.62,19.18 arc45 7.71,18.96 10.07,16.6 arc45 10.29,16.51 220.98,16.51 222.22,15.27 222.22,13.94 221.93,13.65 0.95,13.65 0,12.7 0,1.27 1.27,0 318.77,0 320.04,1.27 320.04,23.49 318.77,24.77 310.83,24.77 308.29,22.23
L0_0
  Bottom 0.305: R1.1 215.9,58.29 arc45 215.81,58.51 SV1.1
L0_1
  Bottom 0.305: R2.2 SV1.2
L0_2
  Bottom 0.305: R3.1 213.36,58.29 arc45 213.27,58.51 SV1.3
L0_3
  Bottom 0.305: R4.2 SV1.4
L0_4
  Bottom 0.305: R5.1 210.82,58.29 arc45 210.73,58.51 SV1.5
L0_5
  Bottom 0.305: R6.2 SV1.6
L0_6
  Bottom 0.305: R7.1 208.28,58.29 arc45 208.19,58.51 SV1.7
L0_7
  Bottom 0.305: R8.2 SV1.8
L0_8
  Bottom 0.305: R9.1 205.74,58.29 arc45 205.65,58.51 SV1.9
L0_9
  Bottom 0.305: R10.2 SV1.10
L0_10
  Bottom 0.305: R11.1 203.2,58.29 arc45 203.11,58.51 SV1.11
L0_11
  Bottom 0.305: R12.2 SV1.12
L0_12
  Bottom 0.305: R13.1 200.66,58.29 arc45 200.57,58.51 SV1.13
L0_13
  Bottom 0.305: SV1.14 R14.2
L0_14
  Bottom 0.305: R15.1 198.12,58.29 arc45 198.03,58.51 SV1.15
L0_15
  Bottom 0.305: SV1.16 R16.2
L0_16
  Bottom 0.305: R17.1 195.58,58.29 arc45 195.49,58.51 SV1.17
L0_17
  Bottom 0.305: SV1.18 R18.2
L0_18
  Bottom 0.305: R19.1 193.04,58.29 arc45 192.95,58.51 SV1.19
L0_19
  Bottom 0.305: SV1.20 R20.2
L0_20
  Bottom 0.305: R21.1 190.5,58.29 arc45 190.41,58.51 SV1.21
L0_21
  Bottom 0.305: R22.2 SV1.22
L0_22
  Bottom 0.305: R23.1 187.96,58.29 arc45 187.87,58.51 SV1.23
L0_23
  Bottom 0.305: R24.2 SV1.24
L0_24
  Bottom 0.305: R25.1 185.42,58.29 arc45 185.33,58.51 SV1.25
L0_25
  Bottom 0.305: R26.2 SV1.26
L0_26
  Bottom 0.305: R27.1 182.88,58.29 arc45 182.79,58.51 SV1.27
L0_27
  Bottom 0.305: R28.2 SV1.28
L0_28
  Bottom 0.305: R29.1 180.34,58.29 arc45 180.25,58.51 SV1.29
L0_29
  Bottom 0.305: R30.2 SV1.30
L0_30
  Bottom 0.305: R31.1 177.8,58.29 arc45 177.71,58.51 SV1.31
L0_31
  Bottom 0.305: R32.2 SV1.32
L1_0
  Bottom 0.305: R33.1 162.56,58.29 arc45 162.47,58.51 SV2.1
L1_1
  Bottom 0.305: R34.2 SV2.2
L1_2
  Bottom 0.305: R35.1 160.02,58.29 arc45 159.93,58.51 SV2.3
L1_3
  Bottom 0.305: R36.2 SV2.4
L1_4
  Bottom 0.305: R37.1 157.48,58.29 arc45 157.39,58.51 SV2.5
L1_5
  Bottom 0.305: R38.2 SV2.6
L1_6
  Bottom 0.305: R39.1 154.94,58.29 arc45 154.85,58.51 SV2.7
L1_7
  Bottom 0.305: R40.2 SV2.8
L1_8
  Bottom 0.305: R41.1 152.4,58.29 arc45 152.31,58.51 SV2.9
L1_9
  Bottom 0.305: R42.2 SV2.10
L1_10
  Bottom 0.305: R43.1 149.86,58.29 arc45 149.77,58.51 SV2.11
L1_11
  Bottom 0.305: R44.2 SV2.12
L1_12
  Bottom 0.305: R45.1 147.32,58.29 arc45 147.23,58.51 SV2.13
L1_13
  Bottom 0.305: R46.2 SV2.14
L1_14
  Bottom 0.305: R47.1 144.78,58.29 arc45 144.69,58.51 SV2.15
L1_15
  Bottom 0.305: R48.2 SV2.16
L1_16
  Bottom 0.305: R49.1 142.24,58.29 arc45 142.15,58.51 SV2.17
L1_17
  Bottom 0.305: R50.2 SV2.18
L1_18
  Bottom 0.305: R51.1 139.7,58.29 arc45 139.61,58.51 SV2.19
L1_19
  Bottom 0.305: R52.2 SV2.20
L1_20
  Bottom 0.305: R53.1 137.16,58.29 arc45 137.07,58.51 SV2.21
L1_21
  Bottom 0.305: R54.2 SV2.22
L1_22
  Bottom 0.305: R55.1 134.62,58.29 arc45 134.53,58.51 SV2.23
L1_23
  Bottom 0.305: R56.2 SV2.24
L1_24
  Bottom 0.305: R57.1 132.08,58.29 arc45 131.99,58.51 SV2.25
L1_25
  Bottom 0.305: R58.2 SV2.26
L1_26
  Bottom 0.305: R59.1 129.54,58.29 arc45 129.45,58.51 SV2.27
L1_27
  Bottom 0.305: R60.2 SV2.28
L1_28
  Bottom 0.305: R61.1 127,58.29 arc45 126.91,58.51 SV2.29
L1_29
  Bottom 0.305: R62.2 SV2.30
L1_30
  Bottom 0.305: R63.1 124.46,58.29 arc45 124.37,58.51 SV2.31
L1_31
  Bottom 0.305: R64.2 SV2.32
L2_0
  Bottom 0.305: R65.1 109.22,58.29 arc45 109.13,58.51 SV3.1
L2_1
  Bottom 0.305: R66.2 SV3.2
L2_2
  Bottom 0.305: R67.1 106.68,58.29 arc45 106.59,58.51 SV3.3
L2_3
  Bottom 0.305: R68.2 SV3.4
L2_4
  Bottom 0.305: R69.1 104.14,58.29 arc45 104.05,58.51 SV3.5
L2_5
  Bottom 0.305: R70.2 SV3.6
L2_6
  Bottom 0.305: R71.1 101.6,58.29 arc45 101.51,58.51 SV3.7
L2_7
  Bottom 0.305: R72.2 SV3.8
L2_8
  Bottom 0.305: R73.1 99.06,58.29 arc45 98.97,58.51 SV3.9
L2_9
  Bottom 0.305: R74.2 SV3.10
L2_10
  Bottom 0.305: R75.1 96.52,58.29 arc45 96.43,58.51 SV3.11
L2_11
  Bottom 0.305: R76.2 SV3.12
L2_12
  Bottom 0.305: R77.1 93.98,58.29 arc45 93.89,58.51 SV3.13
L2_13
  Bottom 0.305: R78.2 SV3.14
L2_14
  Bottom 0.305: R79.1 91.44,58.29 arc45 91.35,58.51 SV3.15
L2_15
  Bottom 0.305: R80.2 SV3.16
L2_16
  Bottom 0.305: R81.1 88.9,58.29 arc45 88.81,58.51 SV3.17
L2_17
  Bottom 0.305: R82.2 SV3.18
L2_18
  Bottom 0.305: R83.1 86.36,58.29 arc45 86.27,58.51 SV3.19
L2_19
  Bottom 0.305: R84.2 SV3.20
L2_20
  Bottom 0.305: R85.1 83.82,58.29 arc45 83.73,58.51 SV3.21
L2_21
  Bottom 0.305: R86.2 SV3.22
L2_22
  Bottom 0.305: R87.1 81.28,58.29 arc45 81.19,58.51 SV3.23
L2_23
  Bottom 0.305: R88.2 SV3.24
L2_24
  Bottom 0.305: SV3.25 78.65,58.51 arc-45 78.74,58.29 R89.1
L2_25
  Bottom 0.305: R90.2 SV3.26
L2_26
  Bottom 0.305: R91.1 76.2,58.29 arc45 76.11,58.51 SV3.27
L2_27
  Bottom 0.305: R92.2 SV3.28
L2_28
  Bottom 0.305: R93.1 73.66,58.29 arc45 73.57,58.51 SV3.29
L2_29
  Bottom 0.305: R94.2 SV3.30
L2_30
  Bottom 0.305: R95.1 71.12,58.29 arc45 71.03,58.51 SV3.31
L2_31
  Bottom 0.305: R96.2 SV3.32
L3_0
  Bottom 0.305: R97.1 55.88,58.29 arc45 55.79,58.51 SV4.1
L3_1
  Bottom 0.305: R98.2 SV4.2
L3_2
  Bottom 0.305: R99.1 53.34,58.29 arc45 53.25,58.51 SV4.3
L3_3
  Bottom 0.305: R100.2 SV4.4
L3_4
  Bottom 0.305: R101.1 50.8,58.29 arc45 50.71,58.51 SV4.5
L3_5
  Bottom 0.305: R102.2 SV4.6
L3_6
  Bottom 0.305: R103.1 48.26,58.29 arc45 48.17,58.51 SV4.7
L3_7
  Bottom 0.305: R104.2 SV4.8
L3_8
  Bottom 0.305: R105.1 45.72,58.29 arc45 45.63,58.51 SV4.9
L3_9
  Bottom 0.305: R106.2 SV4.10
L3_10
  Bottom 0.305: R107.1 43.18,58.29 arc45 43.09,58.51 SV4.11
L3_11
  Bottom 0.305: R108.2 SV4.12
L3_12
  Bottom 0.305: R109.1 40.64,58.29 arc45 40.55,58.51 SV4.13
L3_13
  Bottom 0.305: R110.2 SV4.14
L3_14
  Bottom 0.305: R111.1 38.1,58.29 arc45 38.01,58.51 SV4.15
L3_15
  Bottom 0.305: R112.2 SV4.16
L3_16
  Bottom 0.305: R113.1 35.56,58.29 arc45 35.47,58.51 SV4.17
L3_17
  Bottom 0.305: R114.2 SV4.18
L3_18
  Bottom 0.305: R115.1 33.02,58.42 SV4.19
L3_19
  Bottom 0.305: R116.2 SV4.20
L3_20
  Bottom 0.305: R117.1 30.48,58.29 arc45 30.39,58.51 SV4.21
L3_21
  Bottom 0.305: R118.2 SV4.22
L3_22
  Bottom 0.305: R119.1 27.94,58.29 arc45 27.85,58.51 SV4.23
L3_23
  Bottom 0.305: R120.2 SV4.24
L3_24
  Bottom 0.305: R121.1 25.4,58.29 arc45 25.31,58.51 SV4.25
L3_25
  Bottom 0.305: R122.2 SV4.26
L3_26
  Bottom 0.305: R123.1 22.86,58.29 arc45 22.77,58.51 SV4.27
L3_27
  Bottom 0.305: R124.2 SV4.28
L3_28
  Bottom 0.305: R125.1 20.32,58.29 arc45 20.23,58.51 SV4.29
L3_29
  Bottom 0.305: R126.2 SV4.30
L3_30
  Bottom 0.305: R127.1 17.78,58.29 arc45 17.69,58.51 SV4.31
L3_31
  Bottom 0.305: R128.2 SV4.32
MOSI
  Top 0.305: SV6.6 241.3,8.12 arc45 241.21,8.35 240.76,8.8 arc45 240.53,8.89 234.45,8.89 arc45 234.22,8.8 233.14,7.71 arc-45 232.91,7.62 216.35,7.62 arc-45 216.12,7.71 215.99,7.84 arc-45 215.9,8.07 IC1.14
N$1
  Top 0.305: IC17.10 218.44,39.24 arc45 218.35,39.46 215.99,41.82 arc-45 215.9,42.04 R1.2
N$2  (via drill 0.65 pad 1.27)
  Top 0.305: IC5.14 v203.2,11.43 | v209.55,6.67 IC1.9
  Bottom 0.305: v203.2,11.43 207.87,6.76 arc45 208.09,6.67 v209.55,6.67
N$3  (via drill 0.65 pad 1.27)
  Top 0.305: IC9.14 v190.5,11.43 | v196.85,6.67 IC5.9
  Bottom 0.305: v190.5,11.43 195.17,6.76 arc45 195.39,6.67 v196.85,6.67
N$4  (via drill 0.65 pad 1.27)
  Top 0.305: IC13.14 v177.8,11.43 | v184.15,6.67 IC9.9
  Bottom 0.305: v177.8,11.43 182.47,6.76 arc45 182.69,6.67 v184.15,6.67
N$5  (via drill 0.65 pad 1.27)
  Top 0.305: IC2.14 v162.56,11.43 | v171.45,6.67 IC13.9
  Bottom 0.305: v162.56,11.43 167.23,6.76 arc45 167.45,6.67 v171.45,6.67
N$6  (via drill 0.65 pad 1.27)
  Top 0.305: IC6.14 v149.86,11.43 | v156.21,6.67 IC2.9
  Bottom 0.305: v149.86,11.43 154.53,6.76 arc45 154.75,6.67 v156.21,6.67
N$7  (via drill 0.65 pad 1.27)
  Top 0.305: IC10.14 v137.16,11.43 | v143.51,6.67 IC6.9
  Bottom 0.305: v137.16,11.43 141.83,6.76 arc45 142.05,6.67 v143.51,6.67
N$8  (via drill 0.65 pad 1.27)
  Top 0.305: IC14.14 v124.46,11.43 | v130.81,6.67 IC10.9
  Bottom 0.305: v124.46,11.43 129.13,6.76 arc45 129.35,6.67 v130.81,6.67
N$9  (via drill 0.65 pad 1.27)
  Top 0.305: IC3.14 v109.22,11.43 | v118.11,6.67 IC14.9
  Bottom 0.305: v109.22,11.43 113.89,6.76 arc45 114.11,6.67 v118.11,6.67
N$10  (via drill 0.65 pad 1.27)
  Top 0.305: IC7.14 v96.52,11.43 | v102.87,6.67 IC3.9
  Bottom 0.305: v96.52,11.43 101.19,6.76 arc45 101.41,6.67 v102.87,6.67
N$11  (via drill 0.65 pad 1.27)
  Top 0.305: IC11.14 v83.82,11.43 | v90.17,6.67 IC7.9
  Bottom 0.305: v83.82,11.43 88.49,6.76 arc45 88.71,6.67 v90.17,6.67
N$12  (via drill 0.65 pad 1.27)
  Top 0.305: IC15.14 v71.12,11.43 | v77.47,6.67 IC11.9
  Bottom 0.305: v71.12,11.43 75.79,6.76 arc45 76.01,6.67 v77.47,6.67
N$13  (via drill 0.65 pad 1.27)
  Top 0.305: IC4.14 v55.88,11.43 | v64.77,6.67 IC15.9
  Bottom 0.305: v55.88,11.43 60.55,6.76 arc45 60.77,6.67 v64.77,6.67
N$14  (via drill 0.6)
  Top 0.305: IC8.14 v43.18,11.43 | v49.53,6.67 IC4.9
  Bottom 0.305: v43.18,11.43 47.85,6.76 arc45 48.07,6.67 v49.53,6.67
N$15  (via drill 0.65 pad 1.27)
  Top 0.305: IC12.14 v30.48,11.43 | v36.83,6.67 IC8.9
  Bottom 0.305: v30.48,11.43 35.15,6.76 arc45 35.37,6.67 v36.83,6.67
N$16  (via drill 0.65 pad 1.27)
  Top 0.305: IC16.14 v17.78,11.43 | v24.13,6.67 IC12.9
  Bottom 0.305: v17.78,11.43 22.45,6.76 arc45 22.67,6.67 v24.13,6.67
N$17
  Top 0.305: IC17.11 217.17,39.24 arc45 217.08,39.46 214.72,41.82 arc-45 214.63,42.04 R2.1
N$18
  Top 0.305: IC17.12 215.9,39.24 arc45 215.81,39.46 213.45,41.82 arc-45 213.36,42.04 R3.2
N$19
  Top 0.305: IC17.13 214.63,39.24 arc45 214.54,39.46 212.18,41.82 arc-45 212.09,42.04 R4.1
N$20
  Top 0.305: IC17.14 213.36,39.24 arc45 213.27,39.46 210.91,41.82 arc-45 210.82,42.04 R5.2
N$21
  Top 0.305: IC17.15 212.09,39.24 arc45 212,39.46 209.64,41.82 arc-45 209.55,42.04 R6.1
N$22
  Top 0.305: IC17.16 210.82,39.24 arc45 210.73,39.46 208.37,41.82 arc-45 208.28,42.04 R7.2
N$23
  Top 0.305: IC32.10 58.42,39.24 arc45 58.33,39.46 55.97,41.82 arc-45 55.88,42.04 R97.2
N$24
  Top 0.305: R98.1 54.61,42.04 arc45 54.7,41.82 57.06,39.46 arc-45 57.15,39.24 IC32.11
N$25
  Top 0.305: IC32.12 55.88,39.24 arc45 55.79,39.46 53.43,41.82 arc-45 53.34,42.04 R99.2
N$26
  Top 0.305: R100.1 52.07,42.04 arc45 52.16,41.82 54.52,39.46 arc-45 54.61,39.24 IC32.13
N$27
  Top 0.305: IC32.14 53.34,39.24 arc45 53.25,39.46 50.89,41.82 arc-45 50.8,42.04 R101.2
N$28
  Top 0.305: R102.1 49.53,42.04 arc45 49.62,41.82 51.98,39.46 arc-45 52.07,39.24 IC32.15
N$29